# EAGLE design 8 Cell Balancing Circuit (EAGLE 5.12)
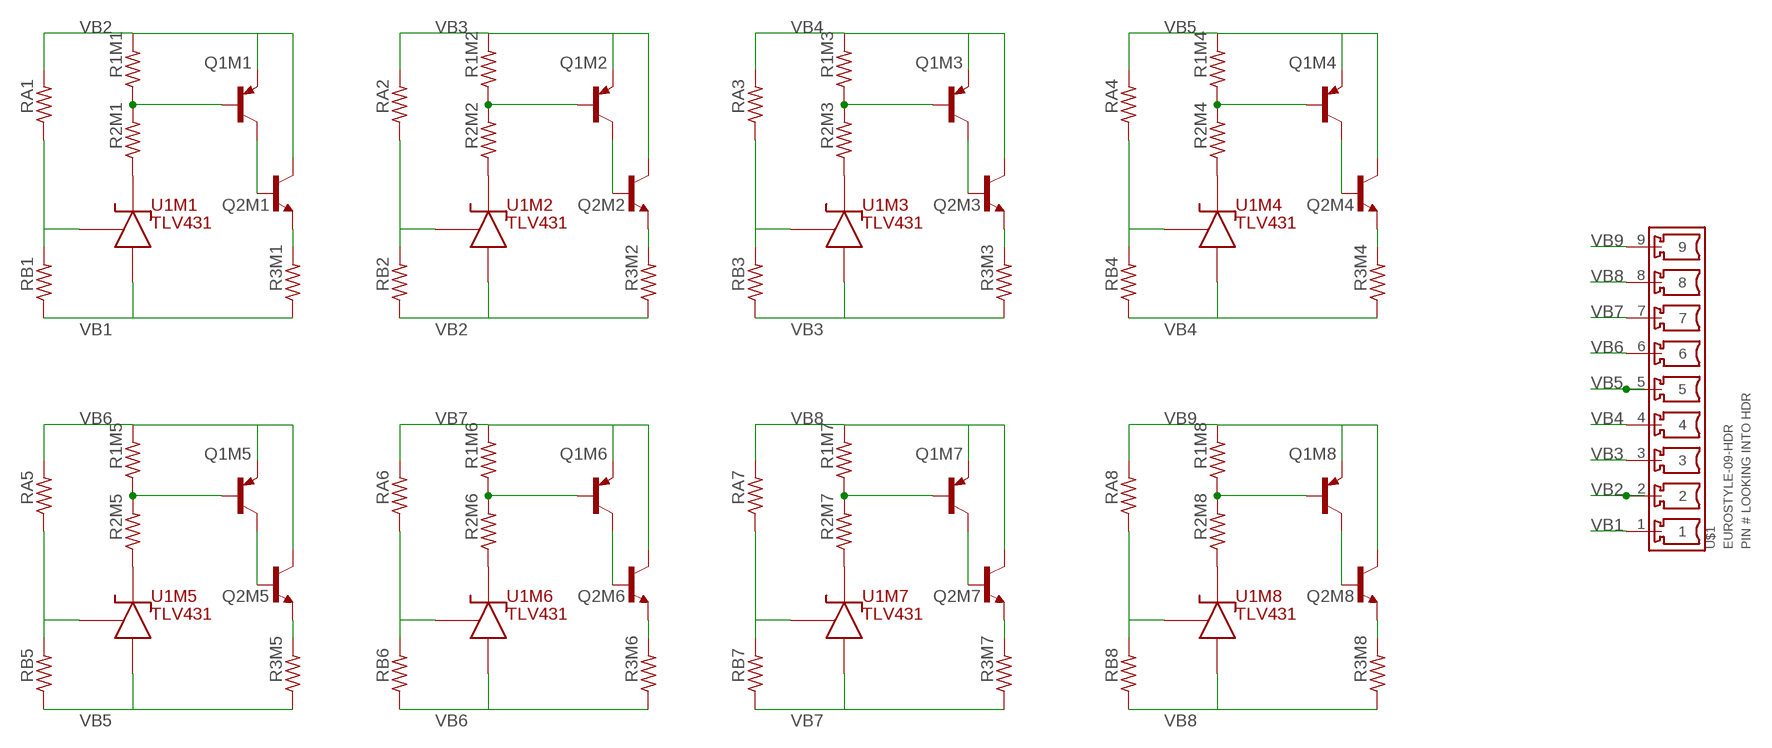
[diagram p0: schematic, sheet 1]

## Parts
Q1M1  MMBT3906LT1SMD  [SOT23-BEC]
Q1M2  MMBT3906LT1SMD  [SOT23-BEC]
Q1M3  MMBT3906LT1SMD  [SOT23-BEC]
Q1M4  MMBT3906LT1SMD  [SOT23-BEC]
Q1M5  MMBT3906LT1SMD  [SOT23-BEC]
Q1M6  MMBT3906LT1SMD  [SOT23-BEC]
Q1M7  MMBT3906LT1SMD  [SOT23-BEC]
Q1M8  MMBT3906LT1SMD  [SOT23-BEC]
Q2M1  -NPN-TO220V  [TO220V]
Q2M2  -NPN-TO220V  [TO220V]
Q2M3  -NPN-TO220V  [TO220V]
Q2M4  -NPN-TO220V  [TO220V]
Q2M5  -NPN-TO220V  [TO220V]
Q2M6  -NPN-TO220V  [TO220V]
Q2M7  -NPN-TO220V  [TO220V]
Q2M8  -NPN-TO220V  [TO220V]
R1M1  R-US_R0603  [R0603]
R1M2  R-US_R0603  [R0603]
R1M3  R-US_R0603  [R0603]
R1M4  R-US_R0603  [R0603]
R1M5  R-US_R0603  [R0603]
R1M6  R-US_R0603  [R0603]
R1M7  R-US_R0603  [R0603]
R1M8  R-US_R0603  [R0603]
R2M1  R-US_R0603  [R0603]
R2M2  R-US_R0603  [R0603]
R2M3  R-US_R0603  [R0603]
R2M4  R-US_R0603  [R0603]
R2M5  R-US_R0603  [R0603]
R2M6  R-US_R0603  [R0603]
R2M7  R-US_R0603  [R0603]
R2M8  R-US_R0603  [R0603]
R3M1  R-US_R0603  [R0603]
R3M2  R-US_R0603  [R0603]
R3M3  R-US_R0603  [R0603]
R3M4  R-US_R0603  [R0603]
R3M5  R-US_R0603  [R0603]
R3M6  R-US_R0603  [R0603]
R3M7  R-US_R0603  [R0603]
R3M8  R-US_R0603  [R0603]
RA1  R-US_R0603  [R0603]
RA2  R-US_R0603  [R0603]
RA3  R-US_R0603  [R0603]
RA4  R-US_R0603  [R0603]
RA5  R-US_R0603  [R0603]
RA6  R-US_R0603  [R0603]
RA7  R-US_R0603  [R0603]
RA8  R-US_R0603  [R0603]
RB1  R-US_R0603  [R0603]
RB2  R-US_R0603  [R0603]
RB3  R-US_R0603  [R0603]
RB4  R-US_R0603  [R0603]
RB5  R-US_R0603  [R0603]
RB6  R-US_R0603  [R0603]
RB7  R-US_R0603  [R0603]
RB8  R-US_R0603  [R0603]
U1M1  TLV431  [SOT-23-5_(DBV-R-PDSO-G5)]
U1M2  TLV431  [SOT-23-5_(DBV-R-PDSO-G5)]
U1M3  TLV431  [SOT-23-5_(DBV-R-PDSO-G5)]
U1M4  TLV431  [SOT-23-5_(DBV-R-PDSO-G5)]
U1M5  TLV431  [SOT-23-5_(DBV-R-PDSO-G5)]
U1M6  TLV431  [SOT-23-5_(DBV-R-PDSO-G5)]
U1M7  TLV431  [SOT-23-5_(DBV-R-PDSO-G5)]
U1M8  TLV431  [SOT-23-5_(DBV-R-PDSO-G5)]
U$1  EUROSTYLE-09-HDR  [EUROSTYLE_HEADER-9CKT-RA]

## Nets
N$1: RA2.1 RB2.2 U1M2.4(P$2.REF)
N$2: Q2M2.3(E) R3M2.2
N$3: Q1M2.C Q2M2.1(B)
N$4: Q1M2.B R1M2.1 R2M2.2
N$5: R2M2.1 U1M2.3(P$1.CATHODE)
N$6: RA3.1 RB3.2 U1M3.4(P$2.REF)
N$7: Q2M3.3(E) R3M3.2
N$8: Q1M3.C Q2M3.1(B)
N$9: Q1M3.B R1M3.1 R2M3.2
N$10: R2M3.1 U1M3.3(P$1.CATHODE)
N$11: RA4.1 RB4.2 U1M4.4(P$2.REF)
N$12: Q2M4.3(E) R3M4.2
N$13: Q1M4.C Q2M4.1(B)
N$14: Q1M4.B R1M4.1 R2M4.2
N$15: R2M4.1 U1M4.3(P$1.CATHODE)
N$16: RA5.1 RB5.2 U1M5.4(P$2.REF)
N$17: Q2M5.3(E) R3M5.2
N$18: Q1M5.C Q2M5.1(B)
N$19: Q1M5.B R1M5.1 R2M5.2
N$20: R2M5.1 U1M5.3(P$1.CATHODE)
N$21: RA6.1 RB6.2 U1M6.4(P$2.REF)
N$22: Q2M6.3(E) R3M6.2
N$23: Q1M6.C Q2M6.1(B)
N$24: Q1M6.B R1M6.1 R2M6.2
N$25: R2M6.1 U1M6.3(P$1.CATHODE)
N$26: RA7.1 RB7.2 U1M7.4(P$2.REF)
N$27: Q2M7.3(E) R3M7.2
N$28: Q1M7.C Q2M7.1(B)
N$29: Q1M7.B R1M7.1 R2M7.2
N$30: R2M7.1 U1M7.3(P$1.CATHODE)
N$31: RA8.1 RB8.2 U1M8.4(P$2.REF)
N$32: Q2M8.3(E) R3M8.2
N$33: Q1M8.C Q2M8.1(B)
N$34: Q1M8.B R1M8.1 R2M8.2
N$35: R2M8.1 U1M8.3(P$1.CATHODE)
N$50: RA1.1 RB1.2 U1M1.4(P$2.REF)
N$53: Q2M1.3(E) R3M1.2
N$54: Q1M1.C Q2M1.1(B)
N$55: Q1M1.B R1M1.1 R2M1.2
N$56: R2M1.1 U1M1.3(P$1.CATHODE)
VB1: R3M1.1 RB1.1 U1M1.5(P$3.ANODE) U$1.1
VB2: Q1M1.E Q2M1.2(C) R1M1.2 R3M2.1 RA1.2 RB2.1 U1M2.5(P$3.ANODE) U$1.2
VB3: Q1M2.E Q2M2.2(C) R1M2.2 R3M3.1 RA2.2 RB3.1 U1M3.5(P$3.ANODE) U$1.3
VB4: Q1M3.E Q2M3.2(C) R1M3.2 R3M4.1 RA3.2 RB4.1 U1M4.5(P$3.ANODE) U$1.4
VB5: Q1M4.E Q2M4.2(C) R1M4.2 R3M5.1 RA4.2 RB5.1 U1M5.5(P$3.ANODE) U$1.5
VB6: Q1M5.E Q2M5.2(C) R1M5.2 R3M6.1 RA5.2 RB6.1 U1M6.5(P$3.ANODE) U$1.6
VB7: Q1M6.E Q2M6.2(C) R1M6.2 R3M7.1 RA6.2 RB7.1 U1M7.5(P$3.ANODE) U$1.7
VB8: Q1M7.E Q2M7.2(C) R1M7.2 R3M8.1 RA7.2 RB8.1 U1M8.5(P$3.ANODE) U$1.8
VB9: Q1M8.E Q2M8.2(C) R1M8.2 RA8.2 U$1.9

## Library data of the parts
Q1M1-Q1M8 = transistor-pnp:MMBT3906*: PNP Transistror
Q2M1-Q2M8 = transistor:*-NPN-: NPN Transistror BF959 corrected 2008.03.06
R1M1-R1M8 R2M1-R2M8 R3M1-R3M8 RA1-RA8 RB1-RB8 = resistor:R-US_: RESISTOR, American symbol
U1M1-U1M8 = TI:TLV431: TLV431 Low-Voltage Adjustable Precision Shunt Regulator
U$1 = Molex:EUROSTYLE-09-HDR

## Board
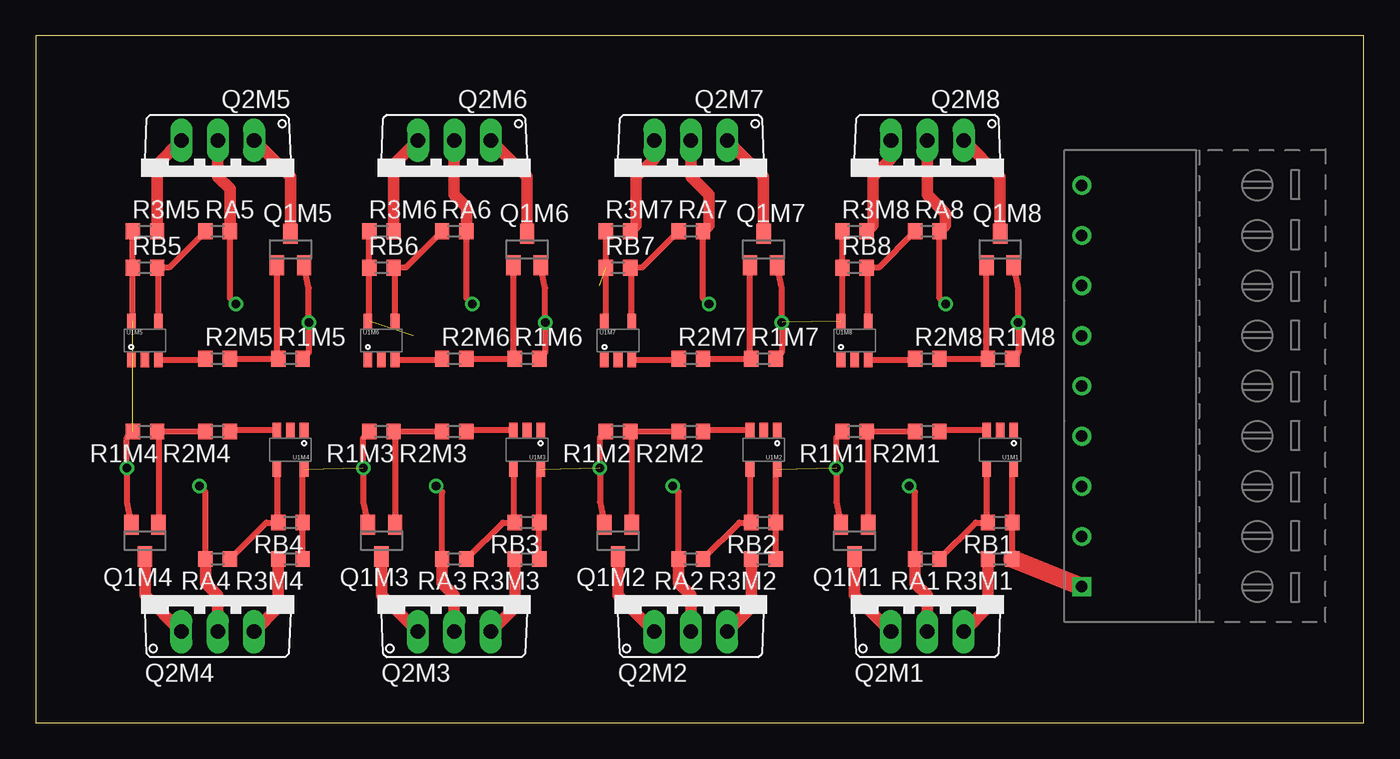
[diagram p1: board, top side]
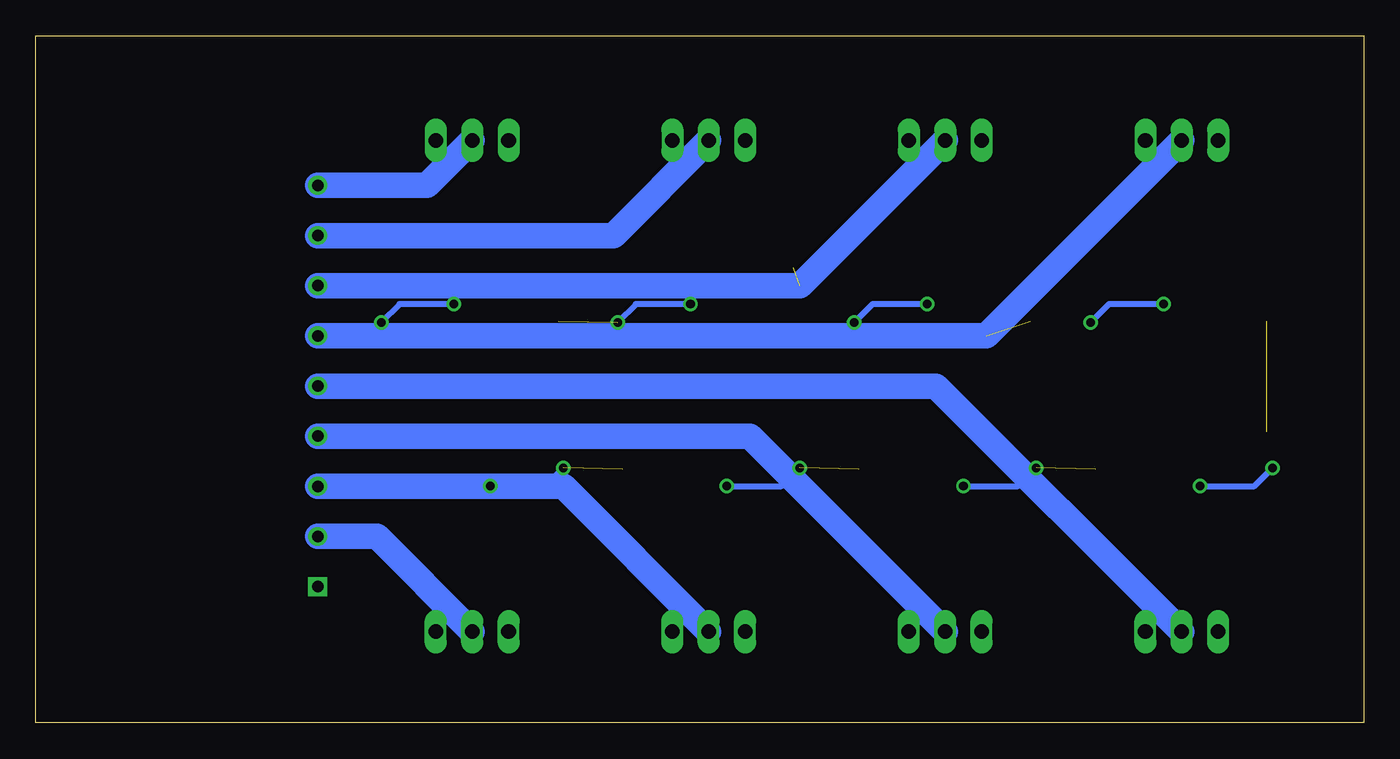
[diagram p2: board, bottom side, seen from below]

Size 92.69 x 47.93 mm. Coordinates in mm from the lower left corner, seen from the top.
Outline: 0,0 92.69,0 92.69,47.93 0,47.93 0,0
Copper layers (1*16): Top 0.035mm / dielectric 1.5mm / Bottom 0.035mm
Design rules "default": minimum track width 10mil, minimum drill 24mil, track to track 8mil, track to pad 8mil, pad to pad 8mil, via to via 8mil, smd to smd 8mil, copper to edge 40mil, drill to drill 8mil, minimum pad ring 10mil, minimum via ring 8mil, stop-mask expansion 4mil, vias tented up to drill 0mil, thermal gap 10mil

### Footprints (pad centres in the part's own frame; a part is rotated, then mirrored left to right if it is on the bottom)
SOT23-BEC = smd 1 x 1.4: B -0.95,-1.1; C 0,1.1; E 0.95,-1.1
TO220V = drill 1.016 long: 1 -2.54,-2.54; 2 0,-2.54; 3 2.54,-2.54
R0603 = smd 1 x 1.1: 1 -0.85,0; 2 0.85,0
SOT-23-5_(DBV-R-PDSO-G5) = smd 0.6 x 1.05: 1 -0.95,-1.35; 2 0,-1.35; 3 0.95,-1.35; 4 0.95,1.35; 5 -0.95,1.35
EUROSTYLE_HEADER-9CKT-RA = drill 0.8 pad 1.22 square: 1 -14,7 | drill 0.8 pad 1.22 round: 2 -10.5,7; 3 -7,7; 4 -3.5,7; 5 0,7; 6 3.5,7; 7 7,7; 8 10.5,7; 9 14,7

### Placement (x,y rotation side)
Q1M1  57.15,12.7 180 top
Q1M2  40.64,12.7 180 top
Q1M3  24.13,12.7 180 top
Q1M4  7.62,12.7 180 top
Q1M5  17.78,33.02 0 top
Q1M6  34.29,33.02 0 top
Q1M7  50.8,33.02 0 top
Q1M8  67.31,33.02 0 top
Q2M1  62.23,8.89 0 top
Q2M2  45.72,8.89 0 top
Q2M3  29.21,8.89 0 top
Q2M4  12.7,8.89 0 top
Q2M5  12.7,38.1 180 top
Q2M6  29.21,38.1 180 top
Q2M7  45.72,38.1 180 top
Q2M8  62.23,38.1 180 top
R1M1  57.15,20.32 180 top
R1M2  40.64,20.32 180 top
R1M3  24.13,20.32 180 top
R1M4  7.62,20.32 180 top
R1M5  17.78,25.4 0 top
R1M6  34.29,25.4 0 top
R1M7  50.8,25.4 0 top
R1M8  67.31,25.4 0 top
R2M1  62.23,20.32 180 top
R2M2  45.72,20.32 180 top
R2M3  29.21,20.32 180 top
R2M4  12.7,20.32 180 top
R2M5  12.7,25.4 0 top
R2M6  29.21,25.4 0 top
R2M7  45.72,25.4 0 top
R2M8  62.23,25.4 0 top
R3M1  67.31,11.43 180 top
R3M2  50.8,11.43 180 top
R3M3  34.29,11.43 180 top
R3M4  17.78,11.43 180 top
R3M5  7.62,34.29 0 top
R3M6  24.13,34.29 0 top
R3M7  40.64,34.29 0 top
R3M8  57.15,34.29 0 top
RA1  62.23,11.43 180 top
RA2  45.72,11.43 180 top
RA3  29.21,11.43 180 top
RA4  12.7,11.43 180 top
RA5  12.7,34.29 0 top
RA6  29.21,34.29 0 top
RA7  45.72,34.29 0 top
RA8  62.23,34.29 0 top
RB1  67.31,13.97 180 top
RB2  50.8,13.97 180 top
RB3  34.29,13.97 180 top
RB4  17.78,13.97 180 top
RB5  7.62,31.75 0 top
RB6  24.13,31.75 0 top
RB7  40.64,31.75 0 top
RB8  57.15,31.75 0 top
U1M1  67.31,19.05 180 top
U1M2  50.8,19.05 180 top
U1M3  34.29,19.05 180 top
U1M4  17.78,19.05 180 top
U1M5  7.62,26.67 0 top
U1M6  24.13,26.67 0 top
U1M7  40.64,26.67 0 top
U1M8  57.15,26.67 0 top
U$1  80.01,23.5 90 top

### Tracks (layer width: path | path; a pad name or v marks a point on that pad's centre or on a via)
N$1
  Top 0.406: U1M2.4 49.85,13.97 RB2.2 49.11,13.97 RA2.1
N$2
  Top 0.813: R3M2.2 49.95,8.04 Q2M2.3
N$3
  Top 0.813: Q1M2.C 40.64,8.89 Q2M2.1
N$4
  Top 0.406: R2M2.2 R1M2.1 41.59,20.32 Q1M2.B
N$5
  Top 0.406: U1M2.3 46.57,20.4 R2M2.1
N$6
  Top 0.406: U1M3.4 33.34,13.97 RB3.2 32.6,13.97 RA3.1
N$7
  Top 0.813: R3M3.2 33.44,8.04 Q2M3.3
N$8
  Top 0.813: Q1M3.C 24.13,8.89 Q2M3.1
N$9
  Top 0.406: R2M3.2 R1M3.1 25.08,20.32 Q1M3.B
N$10
  Top 0.406: U1M3.3 30.06,20.4 R2M3.1
N$11
  Top 0.406: U1M4.4 16.83,13.97 RB4.2 16.09,13.97 RA4.1
N$12
  Top 0.813: R3M4.2 16.93,8.04 Q2M4.3
N$13
  Top 0.813: Q1M4.C 7.62,8.89 Q2M4.1
N$14
  Top 0.406: R2M4.2 R1M4.1 8.57,20.32 Q1M4.B
N$15
  Top 0.406: U1M4.3 13.55,20.4 R2M4.1
N$16
  Top 0.406: U1M5.4 8.57,31.75 RB5.2 9.31,31.75 RA5.1
N$17
  Top 0.813: R3M5.2 8.47,38.95 Q2M5.3
N$18
  Top 0.813: Q1M5.C 17.78,38.1 Q2M5.1
N$19
  Top 0.406: R2M5.2 R1M5.1 16.83,25.4 Q1M5.B
N$20
  Top 0.406: U1M5.3 11.85,25.32 R2M5.1
N$21
  Top 0.406: U1M6.4 25.08,31.75 RB6.2 25.82,31.75 RA6.1
N$22
  Top 0.813: R3M6.2 24.98,38.95 Q2M6.3
N$23
  Top 0.813: Q1M6.C 34.29,38.1 Q2M6.1
N$24
  Top 0.406: R2M6.2 R1M6.1 33.34,25.4 Q1M6.B
N$25
  Top 0.406: U1M6.3 28.36,25.32 R2M6.1
N$26
  Top 0.406: U1M7.4 41.59,31.75 RB7.2 42.33,31.75 RA7.1
N$27
  Top 0.813: Q2M7.3 43.18,39.37 41.91,38.1 41.91,34.71 R3M7.2
N$28
  Top 0.813: Q2M7.1 50.8,38.1 Q1M7.C
N$29
  Top 0.406: R2M7.2 R1M7.1 49.85,25.4 Q1M7.B
N$30
  Top 0.406: U1M7.3 44.87,25.32 R2M7.1
N$31
  Top 0.406: U1M8.4 58.1,31.75 RB8.2 58.84,31.75 RA8.1
N$32
  Top 0.813: Q2M8.3 59.69,39.37 58.42,38.1 58.42,34.71 R3M8.2
N$33
  Top 0.813: Q2M8.1 67.31,38.1 Q1M8.C
N$34
  Top 0.406: R2M8.2 R1M8.1 66.36,25.4 Q1M8.B
N$35
  Top 0.406: U1M8.3 61.38,25.32 R2M8.1
N$50
  Top 0.406: U1M1.4 66.36,13.97 RB1.2 65.62,13.97 RA1.1
N$53
  Top 0.813: R3M1.2 66.46,8.04 Q2M1.3
N$54
  Top 0.813: Q1M1.C 57.15,8.89 Q2M1.1
N$55
  Top 0.406: R2M1.2 R1M1.1 58.1,20.32 Q1M1.B
N$56
  Top 0.406: U1M1.3 63.08,20.4 R2M1.1
VB1
  Top 0.406: U1M1.5 68.16,17.7 RB1.1 R3M1.1
  Top 1.27: R3M1.1 U$1.1
VB2  (via drill 0.6)  (1 unrouted)
  Top 0.406: R1M1.2 55.88,19.9 v55.88,17.78 55.88,15.39 Q1M1.E | v60.96,16.51 61.38,16.09 RA1.2 | U1M2.5 51.65,17.7 RB2.1 R3M2.1
  Top 0.813: RA1.2 61.38,9.74 62.23,8.89 Q2M1.2
  Bottom 0.406: v55.88,17.78 57.15,16.51 v60.96,16.51
  Bottom 1.778: U$1.2 68.88,12.99 Q2M1.2
VB3  (via drill 0.6)  (1 unrouted)
  Top 0.406: R1M2.2 39.37,19.9 v39.37,17.78 39.37,15.39 Q1M2.E | v44.45,16.51 44.87,16.09 RA2.2 | U1M3.5 35.14,17.7 RB3.1 R3M3.1
  Top 0.813: RA2.2 44.87,9.74 45.72,8.89 Q2M2.2
  Bottom 0.406: v39.37,17.78 40.64,16.51 v44.45,16.51
  Bottom 1.778: U$1.3 55.87,16.5 Q2M2.2
VB4  (via drill 0.6)  (1 unrouted)
  Top 0.406: R1M3.2 22.86,19.9 v22.86,17.78 22.86,15.39 Q1M3.E | v27.94,16.51 28.36,16.09 RA3.2 | U1M4.5 18.63,17.7 RB4.1 R3M4.1
  Top 0.813: RA3.2 28.36,9.74 29.21,8.89 Q2M3.2
  Bottom 0.406: v22.86,17.78 24.13,16.51 v27.94,16.51
  Bottom 1.778: U$1.4 42.85,20 Q2M3.2
VB5  (via drill 0.6)  (1 unrouted)
  Top 0.406: R1M4.2 6.35,19.9 v6.35,17.78 6.35,15.39 Q1M4.E | v11.43,16.51 11.85,16.09 RA4.2 | U1M5.5 6.77,28.02 RB5.1 R3M5.1
  Top 0.813: RA4.2 11.85,9.74 12.7,8.89 Q2M4.2
  Bottom 0.406: v6.35,17.78 7.62,16.51 v11.43,16.51
  Bottom 1.778: U$1.5 29.84,23.5 Q2M4.2
VB6  (via drill 0.6)  (1 unrouted)
  Top 0.406: R1M5.2 19.05,25.82 v19.05,27.94 19.05,30.33 Q1M5.E | v13.97,29.21 13.55,29.63 RA5.2 | U1M6.5 23.28,28.02 RB6.1 R3M6.1
  Top 0.813: RA5.2 13.55,37.25 12.7,38.1 Q2M5.2
  Bottom 0.406: v19.05,27.94 17.78,29.21 v13.97,29.21
  Bottom 1.778: U$1.6 26.34,27 Q2M5.2
VB7  (via drill 0.6)  (1 unrouted)
  Top 0.406: R1M6.2 35.56,25.82 v35.56,27.94 35.56,30.33 Q1M6.E | v30.48,29.21 30.06,29.63 RA6.2 | U1M7.5 39.79,28.02 RB7.1 R3M7.1
  Top 0.813: RA6.2 30.06,35.98 29.21,36.83 Q2M6.2
  Bottom 0.406: v35.56,27.94 34.29,29.21 v30.48,29.21
  Bottom 1.778: U$1.7 39.35,30.5 Q2M6.2
VB8  (via drill 0.6)  (1 unrouted)
  Top 0.406: R1M7.2 52.07,25.82 v52.07,27.94 52.07,30.33 Q1M7.E | v46.99,29.21 46.57,29.63 RA7.2 | U1M8.5 56.3,28.02 RB8.1 R3M8.1
  Top 0.813: Q2M7.2 45.72,38.1 46.99,36.83 46.99,34.71 RA7.2
  Bottom 0.406: v52.07,27.94 50.8,29.21 v46.99,29.21
  Bottom 1.778: U$1.8 52.37,33.99 Q2M7.2
VB9  (via drill 0.6)
  Top 0.406: R1M8.2 68.58,25.82 v68.58,27.94 68.58,30.33 Q1M8.E | v63.5,29.21 63.08,29.63 RA8.2
  Top 0.813: Q2M8.2 62.23,36.83 63.5,35.56 63.5,34.71 RA8.2
  Bottom 0.406: v68.58,27.94 67.31,29.21 v63.5,29.21
  Bottom 1.778: U$1.9 65.38,37.49 Q2M8.2